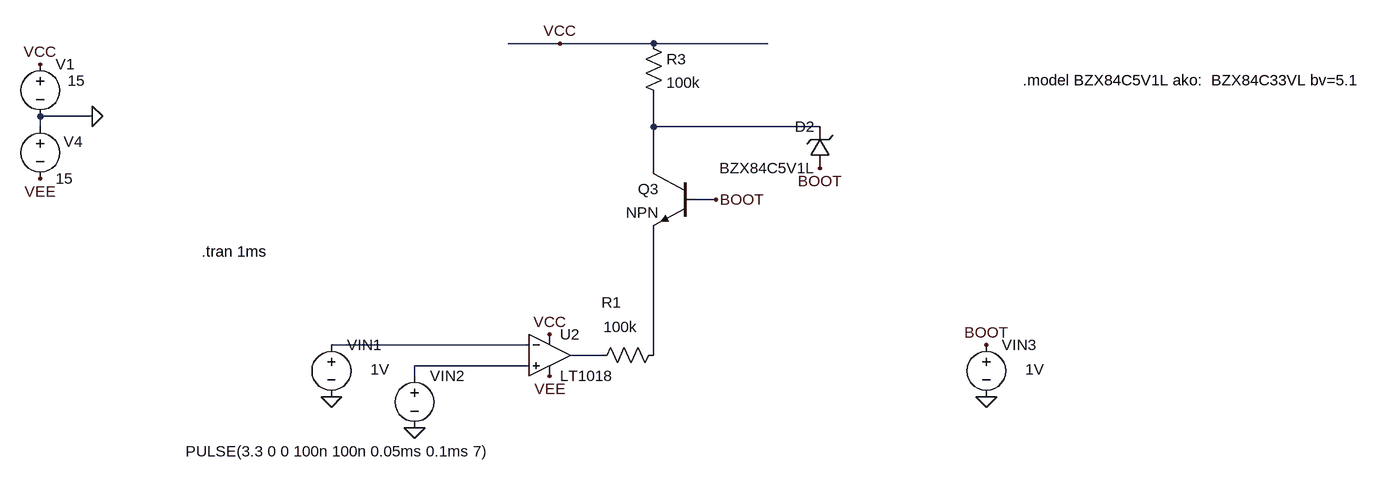
[diagram p0: schematic Draft02.asc]
Draft02.asc, the LTspice schematic file:
Version 4
SHEET 1 2756 2104
WIRE 48 -656 -32 -656
WIRE 192 -656 48 -656
WIRE 368 -656 192 -656
WIRE -672 -544 -752 -544
WIRE -752 -528 -752 -544
WIRE 192 -528 192 -576
WIRE 448 -528 192 -528
WIRE 192 -464 192 -528
WIRE 288 -416 256 -416
WIRE 0 -192 -304 -192
WIRE 112 -176 64 -176
WIRE 192 -176 192 -368
WIRE 0 -160 -176 -160
WIRE -176 -144 -176 -160
FLAG -752 -624 VCC
FLAG -752 -448 VEE
FLAG -672 -544 0
FLAG 32 -208 VCC
FLAG 32 -144 VEE
FLAG -176 -64 0
FLAG -304 -112 0
FLAG 48 -656 VCC
FLAG 288 -416 BOOT
FLAG 448 -464 BOOT
FLAG 704 -112 0
FLAG 704 -192 BOOT
SYMBOL voltage -752 -640 R0
WINDOW 123 0 0 Left 0
WINDOW 39 0 0 Left 0
WINDOW 3 42 41 Left 2
SYMATTR Value 15
SYMATTR InstName V1
SYMBOL voltage -752 -544 R0
WINDOW 123 0 0 Left 0
WINDOW 39 0 0 Left 0
WINDOW 0 36 39 Left 2
SYMATTR InstName V4
SYMATTR Value 15
SYMBOL res 208 -192 R90
WINDOW 0 -50 81 VBottom 2
WINDOW 3 -43 67 VTop 2
SYMATTR InstName R1
SYMATTR Value 100k
SYMBOL Comparators\\LT1018 32 -176 R0
SYMATTR InstName U2
SYMBOL voltage -176 -160 R0
WINDOW 123 0 0 Left 0
WINDOW 39 0 0 Left 0
WINDOW 3 -352 132 Left 2
SYMATTR Value PULSE(3.3 0 0 100n 100n 0.05ms 0.1ms 7)
SYMATTR InstName VIN2
SYMBOL voltage -304 -208 R0
WINDOW 123 0 0 Left 0
WINDOW 39 0 0 Left 0
WINDOW 3 60 54 Left 2
SYMATTR Value 1V
SYMATTR InstName VIN1
SYMBOL npn 256 -464 M0
SYMATTR InstName Q3
SYMBOL res 176 -672 R0
SYMATTR InstName R3
SYMATTR Value 100k
SYMBOL zener 464 -464 R180
WINDOW 0 24 64 Left 2
WINDOW 3 24 0 Left 2
SYMATTR InstName D2
SYMATTR Value BZX84C5V1L
SYMBOL voltage 704 -208 R0
WINDOW 123 0 0 Left 0
WINDOW 39 0 0 Left 0
WINDOW 3 60 54 Left 2
SYMATTR Value 1V
SYMATTR InstName VIN3
TEXT -504 -336 Left 2 !.tran 1ms
TEXT 760 -600 Left 2 !.model BZX84C5V1L ako:  BZX84C33VL bv=5.1

The netlist it stands for:
* Draft02.asc
V1 VCC 0 15
V4 0 VEE 15
R1 N004 N003 100k
XU2 N005 N002 VCC VEE N003 LT1018  ; pins In+ In- V+ V- OUT
VIN2 N005 0 PULSE(3.3 0 0 100n 100n 0.05ms 0.1ms 7)
VIN1 N002 0 1V
Q3 N001 BOOT N004 0 NPN
R3 VCC N001 100k
D2 BOOT N001 BZX84C5V1L
VIN3 BOOT 0 1V
.model D D
.lib standard.dio
.model NPN NPN
.model PNP PNP
.lib standard.bjt
.tran 1ms
.model BZX84C5V1L ako:  BZX84C33VL bv=5.1
.lib LTC1.lib
.backanno
.end